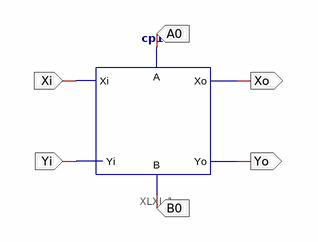
[diagram p0: schematic sheet 1]
// Xilinx ISE schematic h.sch (xc9500) as structural Verilog: 1 symbols, 6 ports
module h (
  input  Xi,
  input  Yi,
  input  B0,
  input  A0,
  output Yo,
  output Xo
);

  cp1b XLXI_1 (.Yi(Yi), .Xo(Xo), .Yo(Yo), .A(A0), .Xi(Xi), .B(B0));
endmodule
